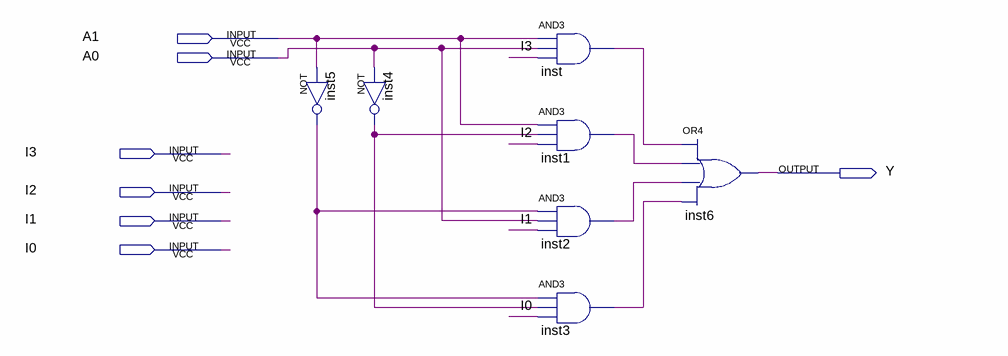
[diagram p0: schematic sheet]
// Quartus schematic Exercise1Question2.bdf as structural Verilog: 7 symbols, 7 pins
module Exercise1Question2 (
  input  A1,
  input  A0,
  input  I3,
  input  I2,
  input  I1,
  input  I0,
  output Y
);

  wire inst1_out, inst2_out, inst3_out, inst4_out, inst5_out, inst_out;

  not inst4 (inst4_out, A0);
  not inst5 (inst5_out, A1);
  and inst (inst_out, A1, A0, I3);
  and inst1 (inst1_out, A1, inst4_out, I2);
  and inst2 (inst2_out, inst5_out, A0, I1);
  and inst3 (inst3_out, inst5_out, inst4_out, I0);
  or inst6 (Y, inst_out, inst1_out, inst2_out, inst3_out);
endmodule
